# Altium schematic sheet powersupply5v.ShcDoc.SchDoc
size A4; SheetNumber: 1; SheetTotal: 1
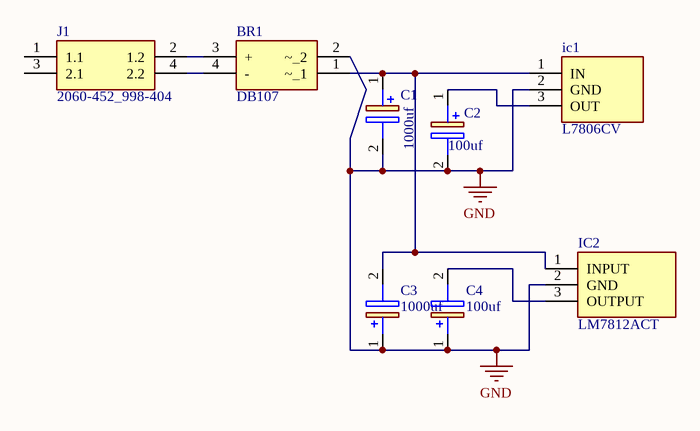
[diagram p0: powersupply5v.ShcDoc.SchDoc]

## Parts
BR1  DB107  [DIP825W50P510L830H340Q4N]
C1  1000uf  [CAPPRD550W60D1050H2150]
C2  100uf  [CAPPRD500W65D1000H3200]
C3  1000uf  [CAPPRD550W60D1050H2150]
C4  100uf  [CAPPRD500W65D1000H3200]
ic1  L7806CV  [TO270P460X1020X2008-3P]
IC2  LM7812ACT  [TO254P470X1016X2019-3P]
J1  2060-452_998-404  [2060452998404]

## Nets
GND: BR1.2(~_2) C1.2(-) C2.2(-) C3.1(+) C4.1(+) ic1.2(GND) IC2.2(GND)
NetBR1_1: BR1.1(~_1) C1.1(+) C3.2(-) ic1.1(IN) IC2.1(INPUT)
NetBR1_3: BR1.3(+) J1.2(1.2)
NetBR1_4: BR1.4(-) J1.4(2.2)
NetC2_1: C2.1(+) ic1.3(OUT)
NetC4_2: C4.2(-) IC2.3(OUTPUT)

Not connected (* = marked no-connect by the designer): J1 1(1.1) 3(2.1)

## Library data of the parts
BR1 = DB107: Bridge Rectifier; Manufacturer_Name: Rectron; Datasheet Link: https://www.rectron.com/data_sheets/db101-107.pdf; Height: 3.4mm; Manufacturer_Part_Number: DB107; Mouser Part Number: 583-DB107; Mouser Price/Stock: https://www.mouser.co.uk/ProductDetail/Rectron/DB107?qs=G5AQjGfRJcLGAY%252B6bEDnbw%3D%3D
C1 C3 = 108CKE025M: Capacitor Polarised; Manufacturer_Name: Cinch Connectivity Solutions; Datasheet Link: https://componentsearchengine.com/Datasheets/2/108CKE025M.pdf; Height: 21.5mm; Manufacturer_Part_Number: 108CKE025M
C2 C4 = EEU-FC2A101L: Capacitor Polarised; Manufacturer_Name: Panasonic; Datasheet Link: http://industrial.panasonic.com/cdbs/www-data/pdf/RDF0000/ABA0000C1209.pdf; Height: 32mm; Manufacturer_Part_Number: EEU-FC2A101L; Mouser Part Number: 667-EEU-FC2A101L; Mouser Price/Stock: https://www.mouser.co.uk/ProductDetail/Panasonic/EEU-FC2A101L?qs=MtOUKumLmnYYrYsMGpDvcw%3D%3D; Arrow Part Number: EEU-FC2A101L; Arrow Price/Stock: https://www.arrow.com/en/products/eeu-fc2a101l/panasonic?region=nac
ic1 = L7806CV: Integrated Circuit; Manufacturer_Name: STMicroelectronics; Datasheet Link: http://www.st.com/web/en/resource/technical/document/datasheet/CD00000444.pdf; Height: 4.6mm; Manufacturer_Part_Number: L7806CV; Mouser Part Number: 511-L7806CV; Mouser Price/Stock: https://www.mouser.co.uk/ProductDetail/STMicroelectronics/L7806CV?qs=K4DpzJ20gDEC%252BHE13eVUwg%3D%3D; Arrow Part Number: L7806CV; Arrow Price/Stock: https://www.arrow.com/en/products/l7806cv/stmicroelectronics?region=europe
IC2 = LM7812ACT: Integrated Circuit; Manufacturer_Name: onsemi; Datasheet Link: https://datasheet.datasheetarchive.com/originals/distributors/Datasheets_SAMA/704b005d7d2d9ced5864f40b6609c1bc.pdf; Height: 4.7mm; Manufacturer_Part_Number: LM7812ACT; Mouser Part Number: 512-LM7812ACT; Mouser Price/Stock: https://www.mouser.com/Search/Refine.aspx?Keyword=512-LM7812ACT; Arrow Part Number: LM7812ACT; Arrow Price/Stock: https://www.arrow.com/en/products/lm7812act/on-semiconductor
J1 = 2060-452_998-404: Connector; Manufacturer_Name: Wago; Manufacturer_Part_Number: 2060-452/998-404; Datasheet Link: https://www.wago.com/2060-452/998-404; Height: 4.5mm; Arrow Part Number: 2060-452/998-404; Arrow Price/Stock: https://www.arrow.com/en/products/2060-452998-404/wago-kontakttechnik-gmbh?region=nac